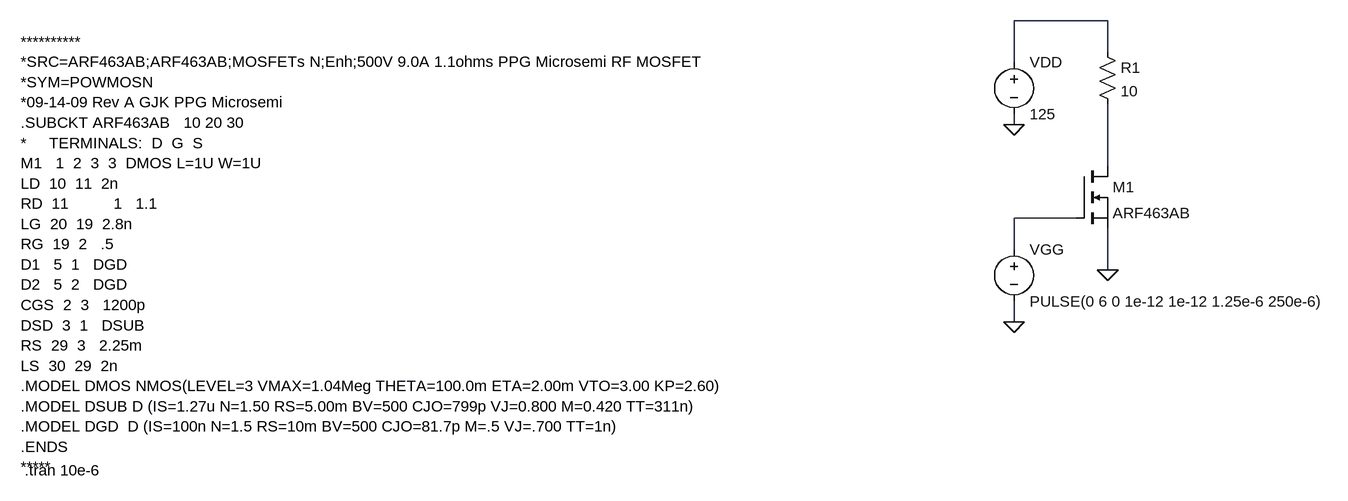
[diagram p0: schematic Clase_A.asc]
Clase_A.asc, the LTspice schematic file:
Version 4
SHEET 1 2376 868
WIRE 1984 160 1840 160
WIRE 1984 208 1984 160
WIRE 1840 224 1840 160
WIRE 1840 320 1840 304
WIRE 1984 384 1984 288
WIRE 1936 464 1840 464
WIRE 1840 512 1840 464
WIRE 1984 544 1984 480
WIRE 1840 624 1840 592
FLAG 1984 544 0
FLAG 1840 320 0
FLAG 1840 624 0
SYMBOL nmos 1936 384 R0
SYMATTR InstName M1
SYMATTR Value ARF463AB
SYMATTR Prefix X
SYMBOL voltage 1840 496 R0
WINDOW 123 0 0 Left 2
WINDOW 39 0 0 Left 2
SYMATTR InstName VGG
SYMATTR Value PULSE(0 6 0 1e-12 1e-12 1.25e-6 250e-6)
SYMBOL voltage 1840 208 R0
WINDOW 123 0 0 Left 2
WINDOW 39 0 0 Left 2
SYMATTR InstName VDD
SYMATTR Value 125
SYMBOL res 1968 192 R0
SYMATTR InstName R1
SYMATTR Value 10
TEXT 318 852 Left 2 !.tran 10e-6
TEXT 312 192 Left 2 !**********\n*SRC=ARF463AB;ARF463AB;MOSFETs N;Enh;500V 9.0A 1.1ohms PPG Microsemi RF MOSFET\n*SYM=POWMOSN\n*09-14-09 Rev A GJK PPG Microsemi\n.SUBCKT ARF463AB   10 20 30\n*     TERMINALS:  D  G  S\nM1   1  2  3  3  DMOS L=1U W=1U\nLD  10  11  2n\nRD  11          1   1.1\nLG  20  19  2.8n\nRG  19  2   .5\nD1   5  1   DGD\nD2   5  2   DGD\nCGS  2  3   1200p\nDSD  3  1   DSUB\nRS  29  3   2.25m\nLS  30  29  2n\n.MODEL DMOS NMOS(LEVEL=3 VMAX=1.04Meg THETA=100.0m ETA=2.00m VTO=3.00 KP=2.60)\n.MODEL DSUB D (IS=1.27u N=1.50 RS=5.00m BV=500 CJO=799p VJ=0.800 M=0.420 TT=311n)\n.MODEL DGD  D (IS=100n N=1.5 RS=10m BV=500 CJO=81.7p M=.5 VJ=.700 TT=1n)\n.ENDS\n*****

The netlist it stands for:
* Clase_A.asc
XM1 N002 N003 0 ARF463AB  ; pins D G S
VGG N003 0 PULSE(0 6 0 1e-12 1e-12 1.25e-6 250e-6)
VDD N001 0 125
R1 N001 N002 10
.tran 10e-6
**********
*SRC=ARF463AB;ARF463AB;MOSFETs N;Enh;500V 9.0A 1.1ohms PPG Microsemi RF MOSFET
*SYM=POWMOSN
*09-14-09 Rev A GJK PPG Microsemi
.SUBCKT ARF463AB   10 20 30
*     TERMINALS:  D  G  S
M1   1  2  3  3  DMOS L=1U W=1U
LD  10  11  2n
RD  11          1   1.1
LG  20  19  2.8n
RG  19  2   .5
D1   5  1   DGD
D2   5  2   DGD
CGS  2  3   1200p
DSD  3  1   DSUB
RS  29  3   2.25m
LS  30  29  2n
.MODEL DMOS NMOS(LEVEL=3 VMAX=1.04Meg THETA=100.0m ETA=2.00m VTO=3.00 KP=2.60)
.MODEL DSUB D (IS=1.27u N=1.50 RS=5.00m BV=500 CJO=799p VJ=0.800 M=0.420 TT=311n)
.MODEL DGD  D (IS=100n N=1.5 RS=10m BV=500 CJO=81.7p M=.5 VJ=.700 TT=1n)
.ENDS
*****
.backanno
.end